# EasyEDA Pro project chunithm.epro, board PCB1
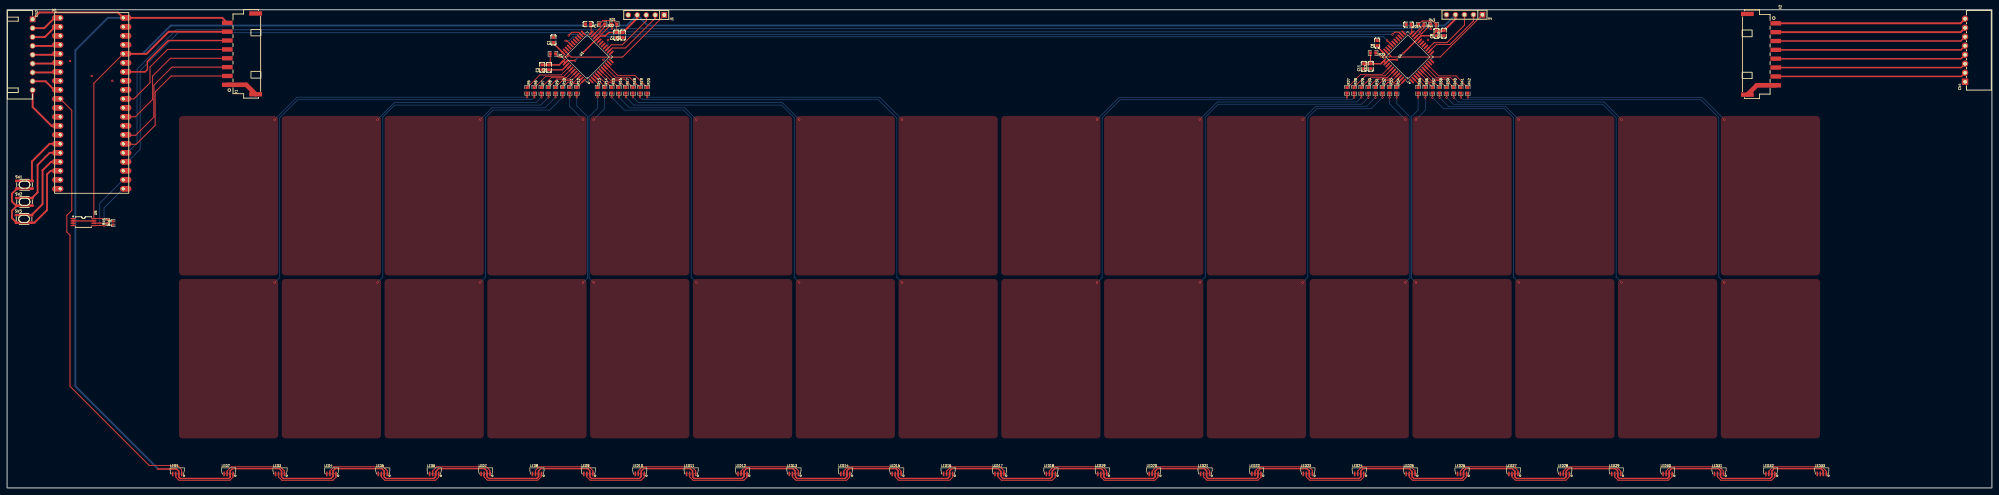
[diagram p5: board, top side]
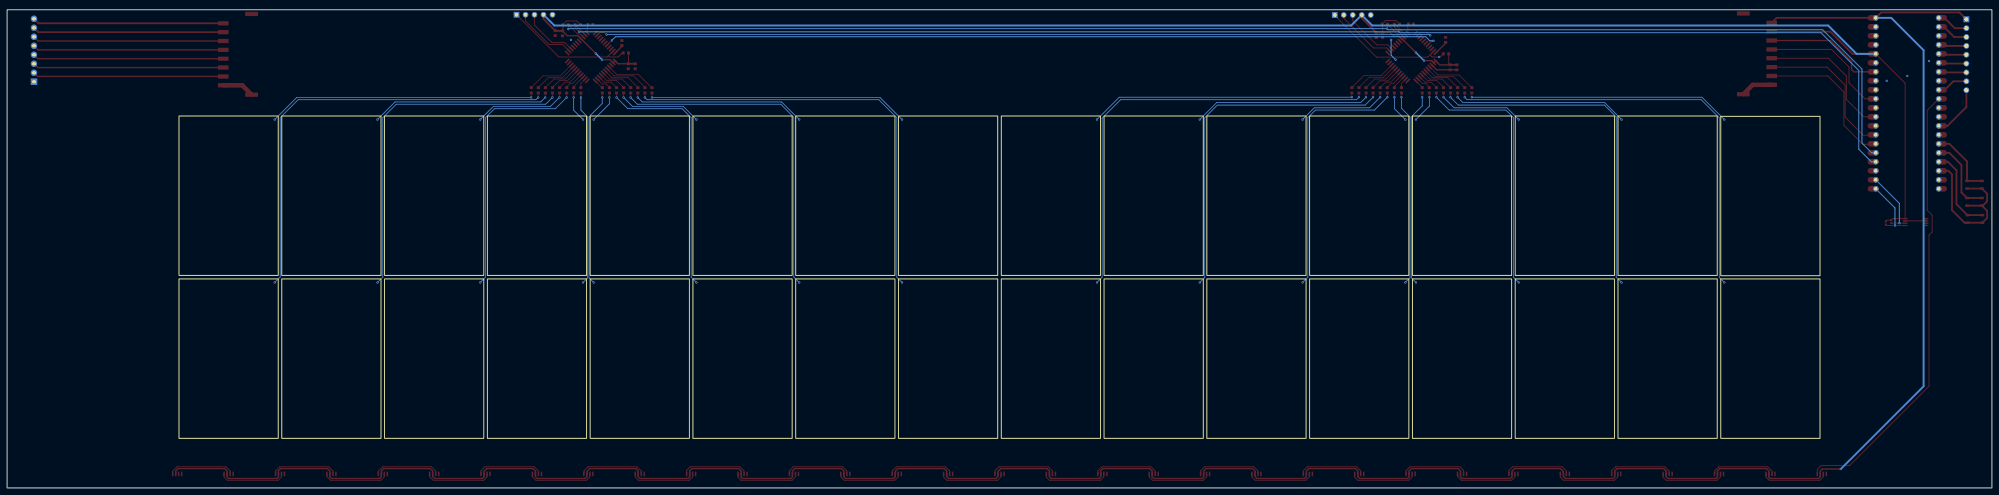
[diagram p6: board, bottom side, seen from below]

Outline 560 x 135 mm; copper layers: Top Layer, Bottom Layer. Coordinates in mm from the lower left corner of the outline.
Outline path: rectangle 0,135 560,0
Stack: Top Layer 0.035mm / Dielectric1 1.51mm FR4 er 4.5 / Bottom Layer 0.035mm

## Design rules (mm)
template: 自定义配置
spacing copperThickness1oz (default): track to track 0.102, other pairs 0.152 to 0.3
spacing copperThickness2oz: track to track 0.203, other pairs 0.152 to 0.3
track width copperThickness1oz (default): min 0.127, default 0.254, max 2.54
track width copperThickness2oz: min 0.203, default 0.254, max 2.54
differential pair differentialPair (default): width min 0.127, default 0.254, max 2.54; gap min 0.152, default 0.152
via viaSize (default): diameter min 0.5, default 0.61, max 10; hole min 0.3, default 0.305, max 6.299
pour e1345 uses copperRegion1

## Placement (name value [footprint] x y rotation side)
C1  1uF  [C0603]  154.14 126.49 90 top
C2  100nF  [C0603]  152.87 118.74 90 top
C3  1uF  [C0603]  150.97 118.74 90 top
C4  100nF  [C0603]  171.9 127.86 90 top
C5  1uF  [C0603]  173.73 127.88 90 top
C7  2.2nF  [C0603]  163.92 130.94 180 top
C8  1uF  [C0603]  386.55 125.6 90 top
C9  100nF  [C0603]  403.29 128.33 90 top
C10  1uF  [C0603]  405.35 128.4 90 top
C11  100nF  [C0603]  382.78 119.04 90 top
C12  1uF  [C0603]  384.74 119.05 90 top
C14  2.2nF  [C0603]  395.44 130.81 180 top
CN2  X8821WR-09S-N0SN  [CONN-TH_9P-P2.50_X8821WR-09S-N2SN]  7.2 122.3 270 top
CN4  XH-8AW  [CONN-TH_8P-P2.54_HCTL_XH-8AW_C2908617]  552.41 123.57 90 top
H1  -  [HDR-TH_5P-P2.54-V-F]  180.34 133.52 180 top
H4  -  [HDR-TH_5P-P2.54-V-F]  411.19 133.6 180 top
LED1  WS2812B-4020  [LED-SMD_WS2812B-4020]  48 3.95 0 top
LED2  WS2812B-4020  [LED-SMD_WS2812B-4020]  62.5 3.95 0 top
LED3  WS2812B-4020  [LED-SMD_WS2812B-4020]  77 3.95 0 top
LED4  WS2812B-4020  [LED-SMD_WS2812B-4020]  91.5 3.95 0 top
LED5  WS2812B-4020  [LED-SMD_WS2812B-4020]  106 3.95 0 top
LED6  WS2812B-4020  [LED-SMD_WS2812B-4020]  120.5 3.95 0 top
LED7  WS2812B-4020  [LED-SMD_WS2812B-4020]  135 3.95 0 top
LED8  WS2812B-4020  [LED-SMD_WS2812B-4020]  149.5 3.95 0 top
LED9  WS2812B-4020  [LED-SMD_WS2812B-4020]  164 3.95 0 top
LED10  WS2812B-4020  [LED-SMD_WS2812B-4020]  178.5 3.95 0 top
LED11  WS2812B-4020  [LED-SMD_WS2812B-4020]  193 3.95 0 top
LED12  WS2812B-4020  [LED-SMD_WS2812B-4020]  207.5 3.95 0 top
LED13  WS2812B-4020  [LED-SMD_WS2812B-4020]  222 3.95 0 top
LED14  WS2812B-4020  [LED-SMD_WS2812B-4020]  236.5 3.95 0 top
LED15  WS2812B-4020  [LED-SMD_WS2812B-4020]  251 3.95 0 top
LED16  WS2812B-4020  [LED-SMD_WS2812B-4020]  265.5 3.95 0 top
LED17  WS2812B-4020  [LED-SMD_WS2812B-4020]  280 3.95 0 top
LED18  WS2812B-4020  [LED-SMD_WS2812B-4020]  294.5 3.95 0 top
LED19  WS2812B-4020  [LED-SMD_WS2812B-4020]  309 3.95 0 top
LED20  WS2812B-4020  [LED-SMD_WS2812B-4020]  323.5 3.95 0 top
LED21  WS2812B-4020  [LED-SMD_WS2812B-4020]  338 3.95 0 top
LED22  WS2812B-4020  [LED-SMD_WS2812B-4020]  352.5 3.95 0 top
LED23  WS2812B-4020  [LED-SMD_WS2812B-4020]  367 3.95 0 top
LED24  WS2812B-4020  [LED-SMD_WS2812B-4020]  381.5 3.95 0 top
LED25  WS2812B-4020  [LED-SMD_WS2812B-4020]  396 3.95 0 top
LED26  WS2812B-4020  [LED-SMD_WS2812B-4020]  410.5 3.95 0 top
LED27  WS2812B-4020  [LED-SMD_WS2812B-4020]  425 3.95 0 top
LED28  WS2812B-4020  [LED-SMD_WS2812B-4020]  439.5 3.95 0 top
LED29  WS2812B-4020  [LED-SMD_WS2812B-4020]  454 3.95 0 top
LED30  WS2812B-4020  [LED-SMD_WS2812B-4020]  468.5 3.95 0 top
LED31  WS2812B-4020  [LED-SMD_WS2812B-4020]  483 3.95 0 top
LED32  WS2812B-4020  [LED-SMD_WS2812B-4020]  497.5 3.95 0 top
LED33  WS2812B-4020  [LED-SMD_WS2812B-4020]  512 3.95 0 top
M1  PI PICO COPY  [pipico]  13.43 83.18 0 top
R1  4.7K  [R0603]  154.02 122.55 180 top
R5  560Ω  [R0603]  146.74 112.27 270 top
R6  560Ω  [R0603]  148.74 112.27 270 top
R7  560Ω  [R0603]  150.74 112.27 270 top
R8  560Ω  [R0603]  152.74 112.27 270 top
R9  560Ω  [R0603]  154.74 112.27 270 top
R10  560Ω  [R0603]  156.74 112.27 270 top
R11  560Ω  [R0603]  158.74 112.27 270 top
R12  560Ω  [R0603]  160.74 112.27 270 top
R13  560Ω  [R0603]  166.59 112.27 270 top
R14  560Ω  [R0603]  168.59 112.27 270 top
R15  560Ω  [R0603]  170.59 112.27 270 top
R16  560Ω  [R0603]  172.59 112.27 270 top
R17  560Ω  [R0603]  174.59 112.27 270 top
R18  560Ω  [R0603]  176.59 112.27 270 top
R19  560Ω  [R0603]  178.59 112.27 270 top
R20  560Ω  [R0603]  180.59 112.27 270 top
R21  2.2kΩ  [R0603]  171.29 130.94 0 top
R22  2.2kΩ  [R0603]  167.86 130.94 180 top
R23  4.7K  [R0603]  385.41 122.81 180 top
R27  560Ω  [R0603]  378.04 112.27 270 top
R28  560Ω  [R0603]  380.04 112.27 270 top
R29  560Ω  [R0603]  382.04 112.27 270 top
R30  560Ω  [R0603]  384.04 112.27 270 top
R31  560Ω  [R0603]  386.04 112.27 270 top
R32  560Ω  [R0603]  388.04 112.27 270 top
R33  560Ω  [R0603]  390.04 112.27 270 top
R34  560Ω  [R0603]  392.04 112.27 270 top
R35  560Ω  [R0603]  398.11 112.27 270 top
R36  560Ω  [R0603]  400.11 112.27 270 top
R37  560Ω  [R0603]  402.11 112.27 270 top
R38  560Ω  [R0603]  404.11 112.27 270 top
R39  560Ω  [R0603]  406.11 112.27 270 top
R40  560Ω  [R0603]  408.11 112.27 270 top
R41  560Ω  [R0603]  410.11 112.27 270 top
R42  560Ω  [R0603]  412.11 112.27 270 top
R43  2.2kΩ  [R0603]  402.43 130.81 0 top
R44  2.2kΩ  [R0603]  399 130.81 180 top
R45  10K  [R0402]  28.41 75.18 90 top
R46  10K  [R0402]  29.94 74.8 90 top
SW1  SKRPACE010  [KEY-SMD_4P-L4.2-W3.2-P2.20-LS4.6]  4.92 85.6 0 top
SW2  SKRPACE010  [KEY-SMD_4P-L4.2-W3.2-P2.20-LS4.6]  4.92 80.77 0 top
SW3  SKRPACE010  [KEY-SMD_4P-L4.2-W3.2-P2.20-LS4.6]  4.79 75.94 0 top
U1  CY8C4245AXI-483  [TQFP-44_L10.0-W10.0-P0.80-BL]  163.67 121.66 45 top
U4  CY8C4245AXI-483  [TQFP-44_L10.0-W10.0-P0.80-BL]  395.19 121.66 45 top
U5  -  [TSSOP-8_L4.4-W3.0-P0.65-LS6.4-BL]  21.56 75.06 270 top
X1  AFC25-S08DCA-00  [CONN-SMD_8P-P2.50-L10.5-W25.0]  66.13 122.55 90 top
X2  AFC25-S08DCA-00  [CONN-SMD_8P-P2.50-L10.5-W25.0]  495.01 122.43 270 top

## Footprints (pads in the part's own frame, mm; a bottom-side part is the same pattern mirrored in y, then rotated)
C0603
  rect 0.8x0.9 smd: 1(-0.7,0) 2(0.7,0)
CONN-SMD_8P-P2.50-L10.5-W25.0
  rect 1.2x3.6 smd: 0(-11.4,-4) 0(11.4,-4)
  rect 1.2x3 smd: 1(-8.75,4) 2(-6.25,4) 3(-3.75,4) 4(-1.25,4) 5(1.25,4) 6(3.75,4) 7(6.25,4) 8(8.75,4)
CONN-TH_8P-P2.54_HCTL_XH-8AW_C2908617
  rect 1.8x1.8 hole 1: 1(-8.89,0)
  round 1.8 hole 1: 2(-6.35,0) 3(-3.81,0) 4(-1.27,0) 5(1.27,0) 6(3.81,0) 7(6.35,0) 8(8.89,0)
CONN-TH_9P-P2.50_X8821WR-09S-N2SN
  rect 1.6x1.6 hole 1.1: 1(-10,0)
  round 1.6 hole 1.1: 2(-7.5,0) 3(-5,0) 4(-2.5,0) 5(0,0) 6(2.5,0) 7(5,0) 8(7.5,0) 9(10,0)
HDR-TH_5P-P2.54-V-F
  rect 1.575x1.575 hole 1.02: 1(-5.08,0)
  round 1.575 hole 1.02: 2(-2.54,0) 3(0,0) 4(2.54,0) 5(5.08,0)
KEY-SMD_4P-L4.2-W3.2-P2.20-LS4.6
  rect 1.05x0.7 smd: 1(-2.1,1.075) 2(2.1,1.075) 3(-2.1,-1.075) 4(2.1,-1.075)
LED-SMD_WS2812B-4020
  rect 0.42x1.3 smd: 1(1.275,0) 2(0.425,0) 3(-0.425,0) 4(-1.275,0)
pipico
  oval 3.2x1.6 smd: 1(0.86,49.53) 2(0.86,46.99) 3(0.86,44.45) 4(0.86,41.91) 5(0.86,39.37) 6(0.86,36.83) 7(0.86,34.29) 8(0.86,31.75) 9(0.86,29.21) 10(0.86,26.67) 11(0.86,24.13) 12(0.86,21.59) 13(0.86,19.05) 14(0.86,16.51) 15(0.86,13.97) 16(0.86,11.43) 17(0.86,8.89) 18(0.86,6.35) 19(0.86,3.81) 20(0.86,1.27) 21(20.04,1.27) 22(20.04,3.81) 23(20.04,6.35) 24(20.04,8.89) 25(20.04,11.43) 26(20.04,13.97) 27(20.04,16.51) 28(20.04,19.05) 29(20.04,21.59) 30(20.04,24.13) 31(20.04,26.67) 32(20.04,29.21) 33(20.04,31.75) 34(20.04,34.29) 35(20.04,36.83) 36(20.04,39.37) 37(20.04,41.91) 38(20.04,44.45) 39(20.04,46.99) 40(20.04,49.53)
  round 1.524 hole 0.914: 1(1.56,49.53) 2(1.56,46.99) 3(1.56,44.45) 4(1.56,41.91) 5(1.56,39.37) 6(1.56,36.83) 7(1.56,34.29) 8(1.56,31.75) 9(1.56,29.21) 10(1.56,26.67) 11(1.56,24.13) 12(1.56,21.59) 13(1.56,19.05) 14(1.56,16.51) 15(1.56,13.97) 16(1.56,11.43) 17(1.56,8.89) 18(1.56,6.35) 19(1.56,3.81) 20(1.56,1.27) 21(19.34,1.27) 22(19.34,3.81) 23(19.34,6.35) 24(19.34,8.89) 25(19.34,11.43) 26(19.34,13.97) 27(19.34,16.51) 28(19.34,19.05) 29(19.34,21.59) 30(19.34,24.13) 31(19.34,26.67) 32(19.34,29.21) 33(19.34,31.75) 34(19.34,34.29) 35(19.34,36.83) 36(19.34,39.37) 37(19.34,41.91) 38(19.34,44.45) 39(19.34,46.99) 40(19.34,49.53)
R0402
  rect 0.566x0.54 smd: 1(-0.433,0) 2(0.433,0)
R0603
  rect 0.806x0.864 smd: 1(-0.753,0) 2(0.753,0)
TQFP-44_L10.0-W10.0-P0.80-BL
  oval 0.448x1.745 smd: 1(-4,-5.58) 2(-3.2,-5.58) 3(-2.4,-5.58) 4(-1.6,-5.58) 5(-0.8,-5.58) 6(0,-5.58) 7(0.8,-5.58) 8(1.6,-5.58) 9(2.4,-5.58) 10(3.2,-5.58) 11(4,-5.58) 23(4,5.58) 24(3.2,5.58) 25(2.4,5.58) 26(1.6,5.58) 27(0.8,5.58) 28(0,5.58) 29(-0.8,5.58) 30(-1.6,5.58) 31(-2.4,5.58) 32(-3.2,5.58) 33(-4,5.58)
  oval 1.745x0.448 smd: 12(5.58,-4) 13(5.58,-3.2) 14(5.58,-2.4) 15(5.58,-1.6) 16(5.58,-0.8) 17(5.58,0) 18(5.58,0.8) 19(5.58,1.6) 20(5.58,2.4) 21(5.58,3.2) 22(5.58,4) 34(-5.58,4) 35(-5.58,3.2) 36(-5.58,2.4) 37(-5.58,1.6) 38(-5.58,0.8) 39(-5.58,0) 40(-5.58,-0.8) 41(-5.58,-1.6) 42(-5.58,-2.4) 43(-5.58,-3.2) 44(-5.58,-4)
TSSOP-8_L4.4-W3.0-P0.65-LS6.4-BL
  oval 0.353x1.454 smd: 1(-0.975,-2.927) 2(-0.325,-2.927) 3(0.325,-2.927) 4(0.975,-2.927) 5(0.975,2.927) 6(0.325,2.927) 7(-0.325,2.927) 8(-0.975,2.927)

## Nets
As in the schematic, except:
LEFT_READY: U1.24 U4.24

Pads without a net: LED33 3; M1 11 12 14 19 20 30 32 35 37 39

## Via types
v1: diameter 0.61, hole 0.305, Top Layer to Bottom Layer, 86 vias

## Routing (per net, layer and track width the routed paths; a pad name or vN(x,y) marks a point on that pad's centre or on a via; arc(x,y) is an arc through that point)
+3.3V: length 558.7
  Top Layer w0.254: R46.2 29.56,75.62 R45.2 28,76.03 24.48,76.03 24.48,114.27 M1.36 ; C9.2 403.18,129.14 R43.2 402.17,131.82 399.26,131.82 R44.2 ; R23.2 384.66,119.83 C12.2 ; C2.2 153.26,119.83 R1.2 ; R22.2 168.12,131.95 171.03,131.95 172.04,130.94 R21.2 171.9,130.79 C4.2
  Top Layer w0.381: v1(162.53,122.94) 166.33,126.74 U1.19 167.34,127.6 168.78,127.6 169.74,128.56 C4.2 ; C12.2 387.62,119.75 388.42,120.55 U4.35 389.9,120.9 v1(392.14,120.9) ; C2.2 155.79,119.44 U1.34 U1.35 158.13,120.65 v1(160.24,120.65) ; 398.15,126.89 398.93,127.67 401.92,127.67 C9.2 ; 398.15,126.89 U4.19 ; 398.15,126.89 398.12,126.89 v1(393.92,122.68)
  Top Layer w0.508: 408.65,133.6 408.65,132.4 C10.2 405.29,129.03 C9.2 ; C11.2 382.79,119.75 C12.2 ; C4.2 173.72,128.56 C5.2 177.8,132.65 H1.4 ; C3.2 C2.2 ; M1.36 39.33,122.55 45.58,128.8 X1.7
  Bottom Layer w0.381: v1(392.14,120.9) v1(393.92,122.68) ; v1(160.24,120.65) v1(162.53,122.94)
  Bottom Layer w0.508: M1.36 38.19,122.55 46.19,130.56 174.83,130.56 H1.4 180.77,130.56 405.6,130.56 408.65,133.6
+5V: length 739.9
  Top Layer w0.381: v1(42.64,5.33) 47.84,5.33 48.42,4.75 LED1.2 48.42,3.12 48.88,2.67 62.58,2.67 62.96,3.05 62.96,3.92 LED2.2 62.92,4.78 63.61,5.46 76.8,5.46 77.44,4.82 77.44,3.96 LED3.2 77.42,3.12 77.88,2.67 91.41,2.67 91.92,3.19 LED4.2 91.92,4.78 92.61,5.46 105.76,5.46 106.39,4.82 106.39,3.99 LED5.2 106.42,3.12 106.88,2.67 120.36,2.67 120.87,3.17 120.87,3.9 LED6.2 120.92,4.63 121.76,5.46 134.71,5.46 135.35,4.82 135.35,4.03 LED7.2 135.43,3.12 135.88,2.67 149.44,2.67 149.95,3.17 149.95,3.92 LED8.2 149.93,4.78 150.61,5.46 163.8,5.46 164.43,4.82 164.43,3.96 LED9.2 164.43,3.12 164.88,2.67 178.4,2.67 178.91,3.17 178.91,3.93 LED10.2 178.93,4.78 179.61,5.46 192.75,5.46 193.39,4.82 193.39,3.99 LED11.2 193.43,3.12 193.88,2.67 207.36,2.67 207.93,3.24 LED12.2 207.93,4.78 208.61,5.46 221.71,5.46 222.34,4.82 222.34,4.03 LED13.2 222.43,3.12 222.88,2.67 236.44,2.67 236.95,3.17 236.95,3.93 LED14.2 236.93,4.78 237.61,5.46 250.79,5.46 251.43,4.82 LED15.2 251.43,3.12 251.88,2.67 265.39,2.67 265.9,3.17 265.9,3.93 LED16.2 265.93,4.78 266.61,5.46 279.62,5.46 280.38,4.7 280.38,4 LED17.2 280.43,3.26 281.02,2.67 294.35,2.67 294.86,3.17 294.86,3.88 LED18.2 294.93,4.78 295.61,5.46 308.7,5.46 309.34,4.82 309.34,4.04 LED19.2 309.43,3.12 309.88,2.67 323.43,2.67 323.94,3.17 323.94,3.93 LED20.2 323.93,4.78 324.61,5.46 337.78,5.46 338.42,4.82 338.42,3.96 LED21.2 338.43,3.12 338.88,2.67 352.52,2.67 352.9,3.05 352.9,3.92 LED22.2 352.93,4.78 353.61,5.46 366.74,5.46 367.38,4.82 367.38,4 LED23.2 367.43,3.12 367.88,2.67 381.47,2.67 381.98,3.17 381.98,3.9 LED24.2 381.93,4.78 382.61,5.46 395.57,5.46 396.33,4.7 396.33,4.04 LED25.2 396.43,3.12 396.88,2.67 410.43,2.67 410.94,3.17 410.94,3.94 LED26.2 410.93,4.78 411.61,5.46 424.65,5.46 425.42,4.7 425.42,3.96 LED27.2 425.43,3.12 425.88,2.67 439.38,2.67 439.89,3.17 439.89,3.92 LED28.2 439.93,4.78 440.61,5.46 453.74,5.46 454.37,4.82 454.37,4 LED29.2 454.43,3.12 454.88,2.67 468.47,2.67 468.98,3.17 468.98,3.9 LED30.2 468.93,4.78 469.61,5.46 482.82,5.46 483.45,4.82 483.45,3.98 LED31.2 483.43,3.12 483.88,2.67 497.42,2.67 497.93,3.17 497.93,3.94 LED32.2 497.93,4.78 498.61,5.46 511.77,5.46 512.41,4.82 512.41,3.97 LED33.2
  Top Layer w0.508: M1.40 31.24,134.24 9.14,134.24 CN2.1 ; X1.8 60.72,132.71 M1.40
  Bottom Layer w0.508: M1.40 28.41,132.71 19.27,123.57 19.27,28.7 v1(42.64,5.33)
GND: length 98.6
  Top Layer w0.254: U5.2 U5.3 U5.4 ; U5.2 18.63,76.03 ; U5.2 U5.7
  Top Layer w0.381: C3.1 C2.1 156.65,118.04 U1.36
  Top Layer w0.508: M1.18 12.28,89.53 11.27,88.52 11.27,78.43 7.71,74.87 SW3.3 1.36,76.2 1.36,78.24 SW2.3 ; SW2.3 SW2.4 ; SW2.3 2.56,79.7 1.36,80.9 1.36,83.07 SW1.3 SW1.4 ; M1.13 12.51,102.23 7.2,107.54 CN2.9
  Top Layer w1.27: X1.1 67.48,113.8 X1.0 ; X2.0 493.66,113.68 X2.8
  Bottom Layer w0.254: v1(169.51,126.49) 169.51,122.17 v1(168.24,120.9)
  vias: v1(17.75,120.52) v1(23.88,116.31) v1(29.68,114.93) v1(400.9,126.49)
VCCDA: length 4.1
  Top Layer w0.381: U1.33 154.14,125.53 C1.1
VCCDB: length 2.9
  Top Layer w0.381: C8.1 386.55,124.64 388.42,122.78
CAPSENSE0: length 75.1
  Top Layer w0.203: v1(146.74,110.3) R5.2
  Bottom Layer w0.203: v1(146.74,110.3) 81.8,110.3 v1(75.5,104)
CAPSENSE1: length 122.5
  Top Layer w0.203: v1(148.75,110.3) 148.75,111.5 R6.2
  Bottom Layer w0.203: v1(75.5,58) 76.93,59.43 76.93,104.52 82.01,109.6 148.04,109.6 v1(148.75,110.3)
CAPSENSE2: length 50.1
  Top Layer w0.203: R7.2 150.76,111.49 v1(150.76,110.3)
  Bottom Layer w0.203: v1(150.76,110.3) 149.29,108.84 109.34,108.84 v1(104.5,104)
CAPSENSE3: length 97.7
  Top Layer w0.203: v1(152.77,110.3) 152.77,111.48 R8.2
  Bottom Layer w0.203: v1(152.77,110.3) 150.54,108.08 109.31,108.08 106.01,104.77 106.01,59.51 v1(104.5,58)
CAPSENSE4: length 25.1
  Top Layer w0.203: v1(154.74,110.3) R9.2
  Bottom Layer w0.203: v1(133.5,104) 136.81,107.31 151.75,107.31 v1(154.74,110.3)
CAPSENSE5: length 72.5
  Top Layer w0.203: R10.2 156.73,111.51 v1(156.73,110.3)
  Bottom Layer w0.203: v1(133.5,58) 134.97,59.47 134.97,104.52 137.12,106.68 153.1,106.68 v1(156.73,110.3)
CAPSENSE6: length 9.1
  Top Layer w0.203: v1(158.72,110.3) 158.72,111.5 R11.2
  Bottom Layer w0.203: v1(158.72,110.3) 158.72,107.78 v1(162.5,104)
CAPSENSE7: length 55.3
  Top Layer w0.203: v1(160.73,110.3) 160.73,111.51 R12.2
  Bottom Layer w0.203: v1(162.5,58) 163.8,59.3 163.8,104.77 160.73,107.84 v1(160.73,110.3)
CAPSENSE8: length 55.1
  Top Layer w0.203: v1(166.6,110.3) 166.6,111.5 R13.2
  Bottom Layer w0.203: v1(165.5,58) 164.18,59.32 164.18,104.77 166.6,107.2 v1(166.6,110.3)
CAPSENSE9: length 8.8
  Top Layer w0.203: R14.2 168.58,111.5 v1(168.58,110.3)
  Bottom Layer w0.203: v1(165.5,104) 168.58,107.08 v1(168.58,110.3)
CAPSENSE10: length 73.2
  Top Layer w0.203: v1(170.57,110.3) 170.57,111.5 R15.2
  Bottom Layer w0.203: v1(194.5,58) 193,59.5 193,104.52 190.85,106.68 174.2,106.68 v1(170.57,110.3)
CAPSENSE11: length 25.7
  Top Layer w0.203: v1(172.6,110.3) 172.6,111.5 R16.2
  Bottom Layer w0.203: v1(194.5,104) 191.19,107.31 175.59,107.31 v1(172.6,110.3)
CAPSENSE12: length 98.2
  Top Layer w0.203: R17.2 174.6,111.5 v1(174.6,110.3)
  Bottom Layer w0.203: v1(223.5,58) 222.09,59.41 222.09,104.52 218.53,108.08 176.83,108.08 v1(174.6,110.3)
CAPSENSE13: length 50.7
  Top Layer w0.203: v1(176.59,110.3) 176.59,111.51 R18.2
  Bottom Layer w0.203: v1(223.5,104) 218.66,108.84 178.06,108.84 v1(176.59,110.3)
CAPSENSE14: length 123.1
  Top Layer w0.203: R19.2 178.59,111.51 v1(178.59,110.3)
  Bottom Layer w0.203: v1(178.59,110.3) 179.29,109.6 245.84,109.6 251.04,104.39 251.04,59.46 v1(252.5,58)
CAPSENSE15: length 75.7
  Top Layer w0.203: v1(180.6,110.3) 180.6,111.5 R20.2
  Bottom Layer w0.203: v1(180.6,110.3) 246.2,110.3 v1(252.5,104)
CAPSENSE16: length 74.4
  Top Layer w0.203: v1(378.04,110.23) R27.2
  Bottom Layer w0.203: v1(378.04,110.23) 313.74,110.23 v1(307.5,104)
CAPSENSE17: length 121.9
  Top Layer w0.203: v1(380.06,110.23) 380.06,111.49 R28.2
  Bottom Layer w0.203: v1(307.5,58) 308.96,59.46 308.96,104.52 314.04,109.6 379.43,109.6 v1(380.06,110.23)
CAPSENSE18: length 49.4
  Top Layer w0.203: v1(382.06,110.23) 382.06,111.5 R29.2
  Bottom Layer w0.203: v1(382.06,110.23) 380.79,108.97 341.47,108.97 336.5,104 v1(336.5,104)
CAPSENSE19: length 96.9
  Top Layer w0.203: R30.2 384.09,111.47 v1(384.09,110.23)
  Bottom Layer w0.203: v1(384.09,110.23) 382.18,108.33 341.72,108.33 338.04,104.65 338.04,59.54 v1(336.5,58)
CAPSENSE20: length 24.4
  Top Layer w0.203: v1(386.07,110.23) 386.07,111.49 R31.2
  Bottom Layer w0.203: v1(365.5,104) 369.19,107.69 383.53,107.69 v1(386.07,110.23)
CAPSENSE21: length 71.8
  Top Layer w0.203: v1(388.04,110.23) R32.2
  Bottom Layer w0.203: v1(388.04,110.23) 384.87,107.06 369.53,107.06 367,104.52 367,59.5 v1(365.5,58)
CAPSENSE22: length 9.4
  Top Layer w0.203: R33.2 390.07,111.49 v1(390.07,110.23)
  Bottom Layer w0.203: v1(390.07,110.23) 390.07,108.43 v1(394.5,104)
CAPSENSE23: length 55.6
  Top Layer w0.203: R34.2 392.08,111.47 v1(392.08,110.23)
  Bottom Layer w0.203: v1(394.5,58) 395.82,59.32 395.82,104.77 392.08,108.51 v1(392.08,110.23)
CAPSENSE24: length 54.8
  Top Layer w0.203: R35.2 398.1,111.5 v1(398.1,110.23)
  Bottom Layer w0.203: v1(397.5,58) 396.2,59.3 396.2,104.77 398.1,106.67 v1(398.1,110.23)
CAPSENSE25: length 8.6
  Top Layer w0.203: R36.2 400.14,111.48 v1(400.14,110.23)
  Bottom Layer w0.203: v1(397.5,104) 400.14,106.64 v1(400.14,110.23)
CAPSENSE26: length 73.7
  Top Layer w0.203: R37.2 402.14,111.48 v1(402.14,110.23)
  Bottom Layer w0.203: v1(402.14,110.23) 405.31,107.06 422.49,107.06 425.03,104.52 425.03,59.47 v1(426.5,58)
CAPSENSE27: length 26.2
  Top Layer w0.203: v1(404.15,110.23) 404.15,111.47 R38.2
  Bottom Layer w0.203: v1(404.15,110.23) 406.69,107.69 422.81,107.69 v1(426.5,104)
CAPSENSE28: length 98.7
  Top Layer w0.203: v1(406.13,110.23) 406.13,111.49 R39.2
  Bottom Layer w0.203: v1(406.13,110.23) 408.03,108.33 450.18,108.33 453.99,104.52 453.99,59.51 v1(455.5,58)
CAPSENSE29: length 51.2
  Top Layer w0.203: R40.2 408.16,111.47 v1(408.16,110.23)
  Bottom Layer w0.203: v1(408.16,110.23) 409.43,108.97 450.54,108.97 v1(455.5,104)
CAPSENSE30: length 123.6
  Top Layer w0.203: R41.2 410.15,111.47 v1(410.15,110.23)
  Bottom Layer w0.203: v1(484.5,58) 482.95,59.55 482.95,104.52 477.87,109.6 410.79,109.6 v1(410.15,110.23)
CAPSENSE31: length 76.2
  Top Layer w0.203: v1(412.13,110.23) 412.13,111.49 R42.2
  Bottom Layer w0.203: v1(484.5,104) 478.26,110.23 v1(412.13,110.23)
COIN: length 22
  Top Layer w0.508: SW2.1 SW2.2 8.6,83.43 8.6,91.19 12.03,94.61 M1.16
IR_ADC: length 37
  Top Layer w0.254: M1.31 35.78,109.85 40.33,114.4 40.33,118.85 45.28,123.8 X1.5
IR_RX_ADD0: length 42.2
  Top Layer w0.254: M1.26 33.59,97.03 36.41,97.03 41.77,102.39 41.77,111.78 46.29,116.3 X1.2
IR_RX_ADD1: length 42
  Top Layer w0.254: M1.27 33.59,99.57 36.29,99.57 41.42,104.7 41.42,113.72 46.51,118.8 X1.3
IR_RX_ADD2: length 39.4
  Top Layer w0.254: X1.4 46.09,121.3 41.06,116.28 41.06,109.68 36.16,104.77 M1.29
IR_TX0: length 8.3
  Top Layer w0.508: CN2.2 10.48,129.8 13.4,132.71 M1.1
IR_TX1: length 8.3
  Top Layer w0.508: M1.2 13.53,130.17 10.65,127.3 CN2.3
IR_TX2: length 7.2
  Top Layer w0.508: M1.4 13.99,124.8 CN2.4
IR_TX3: length 7.2
  Top Layer w0.508: CN2.5 14.03,122.3 M1.5
IR_TX4: length 7.2
  Top Layer w0.508: CN2.6 14.07,119.8 M1.6
IR_TX5: length 7.2
  Top Layer w0.508: M1.7 14.11,117.3 CN2.7
LEFT_AIR_RGB: length 8.1
  Top Layer w0.508: CN2.8 10.86,114.8 13.27,112.39 M1.9
LEFT_READY: length 239.9
  Top Layer w0.254: 393.51,127.87 392.73,128.65 391.51,128.65 v1(390.87,128.01) ; 161.99,127.87 161.21,128.65 159.35,128.65 v1(158.46,127.76)
  Bottom Layer w0.254: v1(390.87,128.01) 158.72,128.01 v1(158.46,127.76)
P0_5A: length 236.6
  Top Layer w0.254: v1(157.57,126.24) 157.96,126.24 U1.29 ; U4.29 389.36,126.36 v1(389.35,126.36)
  Bottom Layer w0.254: v1(157.57,126.24) 158.59,126.24 159.73,127.38 388.33,127.38 v1(389.35,126.36)
P1_0A: length 14.3
  Top Layer w0.203: R5.1 150.3,116.59 156.33,116.59 158.59,118.85
P1_0B: length 14.5
  Top Layer w0.203: 390.11,118.85 387.97,116.71 381.85,116.71 378.16,113.02 R27.1
P1_1A: length 12.6
  Top Layer w0.203: 159.16,118.28 157.08,116.2 151.98,116.2 148.8,113.02 R6.1
P1_1B: length 12.9
  Top Layer w0.203: R28.1 380.04,113.12 383.25,116.33 388.72,116.33 390.68,118.28
P1_2A: length 10.9
  Top Layer w0.203: U1.39 157.83,115.82 153.54,115.82 R7.1
P1_2B: length 11.2
  Top Layer w0.203: U4.39 389.35,115.82 384.77,115.82 382.04,113.09 R29.1
P1_3A: length 9.3
  Top Layer w0.203: U1.40 158.58,115.44 155.15,115.44 R8.1
P1_3B: length 9.5
  Top Layer w0.203: U4.40 390.1,115.44 386.47,115.44 R30.1
P1_4A: length 7.6
  Top Layer w0.203: R9.1 154.74,113.11 156.61,114.99 159.26,114.99 U1.41
P1_4B: length 7.8
  Top Layer w0.203: R31.1 388.08,115.06 390.85,115.06 392.38,116.59
P1_5A: length 6
  Top Layer w0.203: R10.1 156.74,113.08 158.21,114.55 159.95,114.55 U1.42
P1_5B: length 6.1
  Top Layer w0.203: U4.42 391.47,114.55 389.6,114.55 388.07,113.02 R32.1
P1_6A: length 4.3
  Top Layer w0.203: R11.1 158.74,113.18 159.73,114.17 160.7,114.17 161.99,115.46
P1_6B: length 4.5
  Top Layer w0.203: R33.1 390.04,113.09 391,114.05 392.09,114.05 U4.43
P1_7A: length 2.6
  Top Layer w0.203: R12.1 160.74,113.08 162.55,114.89
P1_7B: length 2.8
  Top Layer w0.203: 394.07,114.89 392.2,113.02 R34.1
P2_0A: length 2.9
  Top Layer w0.203: R13.1 166.59,114.22 165.35,115.46
P2_0B: length 2.9
  Top Layer w0.203: U4.2 398.11,114.22 R35.1
P2_1A: length 4.1
  Top Layer w0.203: U1.3 168.59,113.35 R14.1
P2_1B: length 4.1
  Top Layer w0.203: U4.3 400.11,113.35 R36.1
P2_2A: length 5.6
  Top Layer w0.203: R15.1 170.59,113.09 169.51,114.17 168.9,114.17 U1.4
P2_2B: length 5.7
  Top Layer w0.203: U4.4 400.42,114.17 401.16,114.17 402.11,113.22 R37.1
P2_3A: length 7.3
  Top Layer w0.203: U1.5 169.65,114.55 171.06,114.55 R16.1
P2_3B: length 7.3
  Top Layer w0.203: U4.5 401.17,114.55 402.58,114.55 R38.1
P2_4A: length 8.9
  Top Layer w0.203: R17.1 172.68,114.93 170.4,114.93 U1.6
P2_4B: length 8.9
  Top Layer w0.203: R39.1 406.11,113.03 404.08,115.06 401.79,115.06 U4.6
P2_5A: length 10.6
  Top Layer w0.203: R18.1 174.17,115.44 171.02,115.44 168.18,118.28
P2_5B: length 10.6
  Top Layer w0.203: R40.1 405.69,115.44 402.54,115.44 399.7,118.28
P2_6A: length 12.3
  Top Layer w0.203: R19.1 175.66,115.95 171.65,115.95 168.75,118.85
P2_6B: length 12.3
  Top Layer w0.203: R41.1 407.31,115.82 403.29,115.82 400.27,118.85
P2_7A: length 13.9
  Top Layer w0.203: U1.9 172.27,116.46 177.15,116.46 R20.1
P2_7B: length 13.9
  Top Layer w0.203: U4.9 403.92,116.33 408.8,116.33 R42.1
P4_0A: length 410.1
  Top Layer w0.254: v1(170.65,129.67) 170.65,130.82 R21.1 167.77,128.17 166.78,128.17 U1.20 ; U4.20 398.3,128.17 399.03,128.17 R43.1 401.67,129.55 v1(401.67,129.54)
  Bottom Layer w0.254: v1(401.67,129.54) 401.54,129.67 v1(170.65,129.67) 170.35,129.36 47.78,129.36 36.67,118.25 36.67,97.37 33.91,94.61 M1.25
P4_1A: length 408
  Top Layer w0.254: 165.35,127.87 168.41,130.94 R22.1 168.61,130.17 v1(167.22,128.78) ; v1(398.62,128.78) 399.75,129.91 R44.1 396.87,127.93 396.87,127.87
  Bottom Layer w0.254: M1.24 34,92.07 37.56,95.63 37.56,117.85 48.22,128.52 166.97,128.52 v1(167.22,128.78) v1(398.62,128.78)
P4_2A: length 2.6
  Top Layer w0.254: 164.78,128.44 164.78,130.77 C7.1
P4_2B: length 2.4
  Top Layer w0.254: C14.1 396.31,130.65 U4.22
PANEL_RGB: length 125.9
  Top Layer w0.254: M1.10 18.25,106.59 18.25,78.36 16.86,76.96 16.86,72.26 17.75,71.37 17.75,28.7 40.1,6.35 48.1,6.35 49.24,5.21 49.24,3.99 LED1.1
RIGHT_AIR_RGB: length 33.7
  Top Layer w0.381: X1.6 45.5,126.3 39.59,120.4 39.59,118.11 38.95,117.47 M1.34
SCL0: length 18.9
  Top Layer w0.254: R45.1 v1(26.12,74.75) 24.5,74.75 U5.6
  Bottom Layer w0.254: v1(26.12,74.75) 26.12,80.34 M1.22
SDA0: length 18.2
  Top Layer w0.254: R46.1 29.65,74.08 v1(27.35,74.08) U5.5
  Bottom Layer w0.254: v1(27.35,74.08) 27.35,79.03 M1.21
SERVICE: length 19
  Top Layer w0.508: M1.15 12,97.15 7.02,92.17 SW1.2 SW1.1
SWDCLKA: length 16
  Top Layer w0.254: U1.14 170.49,125.09 173.57,125.09 180.34,131.86 H1.3
SWDCLKB: length 16.1
  Top Layer w0.254: U4.14 402.65,125.73 406.24,125.73 411.19,130.68 H4.3
SWDIOA: length 17.7
  Top Layer w0.254: H1.2 182.88,132.63 174.45,124.21 170.74,124.21 U1.13
SWDIOB: length 17.6
  Top Layer w0.254: H4.2 413.73,131.82 407.13,125.22 403.27,125.22 401.4,123.35
TEST: length 23.4
  Top Layer w0.508: M1.17 12.41,92.07 10,89.66 10,80.13 6.89,77.02 SW3.1
XRESA: length 38.2
  Top Layer w0.254: 158.29,122.51 U1.32 ; 158.29,122.51 158.29,122.01 157.95,121.66 v1(155.97,121.66) 155.66,121.66 R1.1 ; 158.29,122.51 159.17,121.64 173.64,121.64 185.42,133.41 H1.1
XRESB: length 37.7
  Top Layer w0.254: 416.27,133.6 404.33,121.66 390.66,121.66 390.36,121.97 ; 390.36,121.97 390.05,121.66 387.57,121.66 386.43,122.81 R23.1 ; 390.36,121.97 U4.32
$1N13625: length 18.7
  Top Layer w0.254: LED2.1 63.72,3.9 63.72,3.05 62.83,2.16 48.54,2.16 47.58,3.12 LED1.3
$1N13632: length 18.8
  Top Layer w0.254: LED2.3 62.08,4.78 63.26,5.97 77.05,5.97 78.2,4.82 78.2,4.03 LED3.1
$1N13639: length 18.7
  Top Layer w0.254: LED3.3 76.58,3.12 77.54,2.16 91.91,2.16 92.8,3.05 92.8,3.92 LED4.1
$1N13646: length 18.9
  Top Layer w0.254: LED4.3 91.08,4.78 92.26,5.97 106.14,5.97 107.28,4.82 107.28,3.96 LED5.1
$1N13653: length 18.7
  Top Layer w0.254: LED5.3 105.58,3.12 106.54,2.16 120.87,2.16 121.76,3.05 121.76,3.93 LED6.1
$1N13660: length 18.9
  Top Layer w0.254: LED6.3 120.08,4.78 121.26,5.97 135.22,5.97 136.24,4.95 136.24,3.99 LED7.1
$1N13667: length 18.6
  Top Layer w0.254: LED7.3 134.57,3.12 135.54,2.16 149.7,2.16 150.71,3.17 150.71,3.89 LED8.1
$1N13674: length 19
  Top Layer w0.254: LED9.1 165.32,4 165.32,4.82 164.18,5.97 150.08,5.97 149.07,4.96 LED8.3
$1N13680: length 18.7
  Top Layer w0.254: LED9.3 163.57,3.12 164.54,2.16 178.91,2.16 179.8,3.05 179.8,3.93 LED10.1
$1N13687: length 18.9
  Top Layer w0.254: LED11.1 194.28,4.82 193.13,5.97 179.26,5.97 178.07,4.78 LED10.3
$1N13694: length 18.7
  Top Layer w0.254: LED11.3 192.57,3.12 193.54,2.16 207.86,2.16 208.75,3.05 208.75,3.93 LED12.1
$1N13701: length 18.8
  Top Layer w0.254: LED12.3 207.07,4.78 208.26,5.97 222.09,5.97 223.23,4.82 223.23,4 LED13.1
$1N13708: length 18.7
  Top Layer w0.254: LED14.1 237.71,3.88 237.71,3.05 236.82,2.16 222.54,2.16 221.57,3.12 LED13.3
$1N13715: length 18.8
  Top Layer w0.254: LED15.1 252.19,4.04 252.19,4.82 251.04,5.97 237.26,5.97 236.07,4.78 LED14.3
$1N13722: length 18.7
  Top Layer w0.254: LED15.3 250.57,3.12 251.54,2.16 265.9,2.16 266.79,3.05 266.79,3.93 LED16.1
$1N13729: length 18.9
  Top Layer w0.254: LED17.1 281.27,3.96 281.27,4.82 280.13,5.97 266.26,5.97 265.07,4.78 LED16.3
$1N13735: length 18.7
  Top Layer w0.254: LED18.1 295.75,3.92 295.75,3.05 294.86,2.16 280.54,2.16 279.57,3.12 LED17.3
$1N13742: length 18.8
  Top Layer w0.254: LED18.3 294.07,4.78 295.26,5.97 309.08,5.97 310.23,4.82 310.23,4 LED19.1
$1N13749: length 18.7
  Top Layer w0.254: LED20.1 324.7,3.88 324.7,3.05 323.81,2.16 309.54,2.16 308.57,3.12 LED19.3
$1N13756: length 18.9
  Top Layer w0.254: LED21.1 339.31,3.99 339.31,4.82 338.17,5.97 324.26,5.97 323.07,4.78 LED20.3
$1N13763: length 18.7
  Top Layer w0.254: LED21.3 337.57,3.12 338.54,2.16 352.9,2.16 353.79,3.05 353.79,3.94 LED22.1
$1N13770: length 18.9
  Top Layer w0.254: LED23.1 368.26,3.96 368.26,4.95 367.25,5.97 353.26,5.97 352.07,4.78 LED22.3
$1N13777: length 18.7
  Top Layer w0.254: LED24.1 382.74,3.92 382.74,3.05 381.85,2.16 367.54,2.16 366.57,3.12 LED23.3
$1N13784: length 18.8
  Top Layer w0.254: LED24.3 381.07,4.78 382.26,5.97 396.08,5.97 397.22,4.82 397.22,4 LED25.1
$1N13790: length 18.7
  Top Layer w0.254: LED26.1 411.83,3.9 411.83,3.17 410.81,2.16 396.54,2.16 395.57,3.12 LED25.3
$1N13797: length 18.9
  Top Layer w0.254: LED26.3 410.07,4.78 411.26,5.97 425.16,5.97 426.3,4.82 426.3,3.98 LED27.1
$1N13804: length 18.6
  Top Layer w0.254: LED27.3 424.57,3.12 425.54,2.16 439.77,2.16 440.78,3.17 440.78,3.94 LED28.1
$1N13811: length 18.8
  Top Layer w0.254: LED28.3 439.07,4.78 440.26,5.97 453.99,5.97 455.27,4.68 LED29.1
$1N13818: length 18.6
  Top Layer w0.254: LED29.3 453.57,3.12 454.54,2.16 468.72,2.16 469.77,3.21 LED30.1
$1N13825: length 18.8
  Top Layer w0.254: LED31.1 484.22,4.01 484.22,4.82 483.07,5.97 469.26,5.97 468.07,4.78 LED30.3
$1N13832: length 18.7
  Top Layer w0.254: LED31.3 482.57,3.12 483.54,2.16 497.81,2.16 498.82,3.17 498.82,3.91 LED32.1
$1N13839: length 18.8
  Top Layer w0.254: LED33.1 513.3,3.97 513.3,4.7 512.03,5.97 498.26,5.97 497.07,4.78 LED32.3
$1N18505: length 53.8
  Top Layer w0.381: X2.7 551.37,116.18 CN4.2
$1N18507: length 53.9
  Top Layer w0.381: X2.6 551.33,118.68 CN4.3
$1N18509: length 53.9
  Top Layer w0.381: X2.5 551.29,121.18 CN4.4
$1N18511: length 53.9
  Top Layer w0.381: X2.4 551.25,123.68 CN4.5
$1N18513: length 53.9
  Top Layer w0.381: CN4.6 551.21,126.18 X2.3
$1N18515: length 53.9
  Top Layer w0.508: X2.2 551.17,128.68 CN4.7
$1N18517: length 53.9
  Top Layer w0.508: X2.1 551.13,131.18 CN4.8

## Copper pours and planes (outline as drawn; the poured copper is in the pictures)
GND on Top Layer: 44,111 44.02,111.18 44.07,111.37 44.17,111.55 44.29,111.71 44.45,111.83 44.63,111.93 44.82,111.98 45,112 515,112 515.18,111.98 515.37,111.93 515.55,111.83 515.71,111.71 515.83,111.55 515.93,111.37 515.98,111.18 516,111 516,8 515.98,7.82 515.93,7.63 515.83,7.45 515.71,7.29 515.55,7.17 515.37,7.07 515.18,7.02 515,7 45,7 44.82,7.02 44.63,7.07 44.45,7.17 44.29,7.29 44.17,7.45 44.07,7.63 44.02,7.82 44,8
GND on Top Layer: -26.2,160.02 594.71,160.02 594.71,-20.45 -26.2,-20.45
GND on Bottom Layer: -35.72,145.29 583.28,145.29 583.28,-10.41 -35.72,-10.41
GND on Bottom Layer: 44,111 44.02,111.18 44.07,111.37 44.17,111.55 44.29,111.71 44.45,111.83 44.63,111.93 44.82,111.98 45,112 515,112 515.18,111.98 515.37,111.93 515.55,111.83 515.71,111.71 515.83,111.55 515.93,111.37 515.98,111.18 516,111 516,8 515.98,7.82 515.93,7.63 515.83,7.45 515.71,7.29 515.55,7.17 515.37,7.07 515.18,7.02 515,7 45,7 44.82,7.02 44.63,7.07 44.45,7.17 44.29,7.29 44.17,7.45 44.07,7.63 44.02,7.82 44,8
CAPSENSE0 on Top Layer: 48.5,105 76.5,105 76.5,60 48.5,60
CAPSENSE1 on Top Layer: 48.5,59 76.5,59 76.5,14 48.5,14
CAPSENSE2 on Top Layer: 77.5,105 105.5,105 105.5,60 77.5,60
CAPSENSE3 on Top Layer: 77.5,59 105.5,59 105.5,14 77.5,14
CAPSENSE4 on Top Layer: 106.5,105 134.5,105 134.5,60 106.5,60
CAPSENSE5 on Top Layer: 106.5,59 134.5,59 134.5,14 106.5,14
CAPSENSE6 on Top Layer: 135.5,105 163.5,105 163.5,60 135.5,60
CAPSENSE7 on Top Layer: 135.5,59 163.5,59 163.5,14 135.5,14
CAPSENSE8 on Top Layer: 164.5,59 192.5,59 192.5,14 164.5,14
CAPSENSE9 on Top Layer: 164.5,105 192.5,105 192.5,60 164.5,60
CAPSENSE10 on Top Layer: 193.5,59 221.5,59 221.5,14 193.5,14
CAPSENSE11 on Top Layer: 193.5,105 221.5,105 221.5,60 193.5,60
CAPSENSE12 on Top Layer: 222.5,59 250.5,59 250.5,14 222.5,14
CAPSENSE13 on Top Layer: 222.5,105 250.5,105 250.5,60 222.5,60
CAPSENSE14 on Top Layer: 251.5,59 279.5,59 279.5,14 251.5,14
CAPSENSE15 on Top Layer: 251.5,105 279.5,105 279.5,60 251.5,60
CAPSENSE16 on Top Layer: 280.5,105 308.5,105 308.5,60 280.5,60
CAPSENSE17 on Top Layer: 280.5,59 308.5,59 308.5,14 280.5,14
CAPSENSE18 on Top Layer: 309.5,105 337.5,105 337.5,60 309.5,60
CAPSENSE19 on Top Layer: 309.5,59 337.5,59 337.5,14 309.5,14
CAPSENSE20 on Top Layer: 338.5,105 366.5,105 366.5,60 338.5,60
CAPSENSE21 on Top Layer: 338.5,59 366.5,59 366.5,14 338.5,14
CAPSENSE22 on Top Layer: 367.5,105 395.5,105 395.5,60 367.5,60
CAPSENSE23 on Top Layer: 367.5,59 395.5,59 395.5,14 367.5,14
CAPSENSE24 on Top Layer: 396.5,59 424.5,59 424.5,14 396.5,14
CAPSENSE25 on Top Layer: 396.5,105 424.5,105 424.5,60 396.5,60
CAPSENSE26 on Top Layer: 425.5,59 453.5,59 453.5,14 425.5,14
CAPSENSE27 on Top Layer: 425.5,105 453.5,105 453.5,60 425.5,60
CAPSENSE28 on Top Layer: 454.5,59 482.5,59 482.5,14 454.5,14
CAPSENSE29 on Top Layer: 454.5,105 482.5,105 482.5,60 454.5,60
CAPSENSE30 on Top Layer: 483.5,59 511.5,59 511.5,14 483.5,14
CAPSENSE31 on Top Layer: 483.5,105 511.5,105 511.5,60 483.5,60
XRESA on Top Layer: 157.83,122.51 159.22,122.51 159.22,121.54 157.83,121.54

Small or netless copper shapes (teardrops, artwork), in the pictures only: 2 on Top Layer
